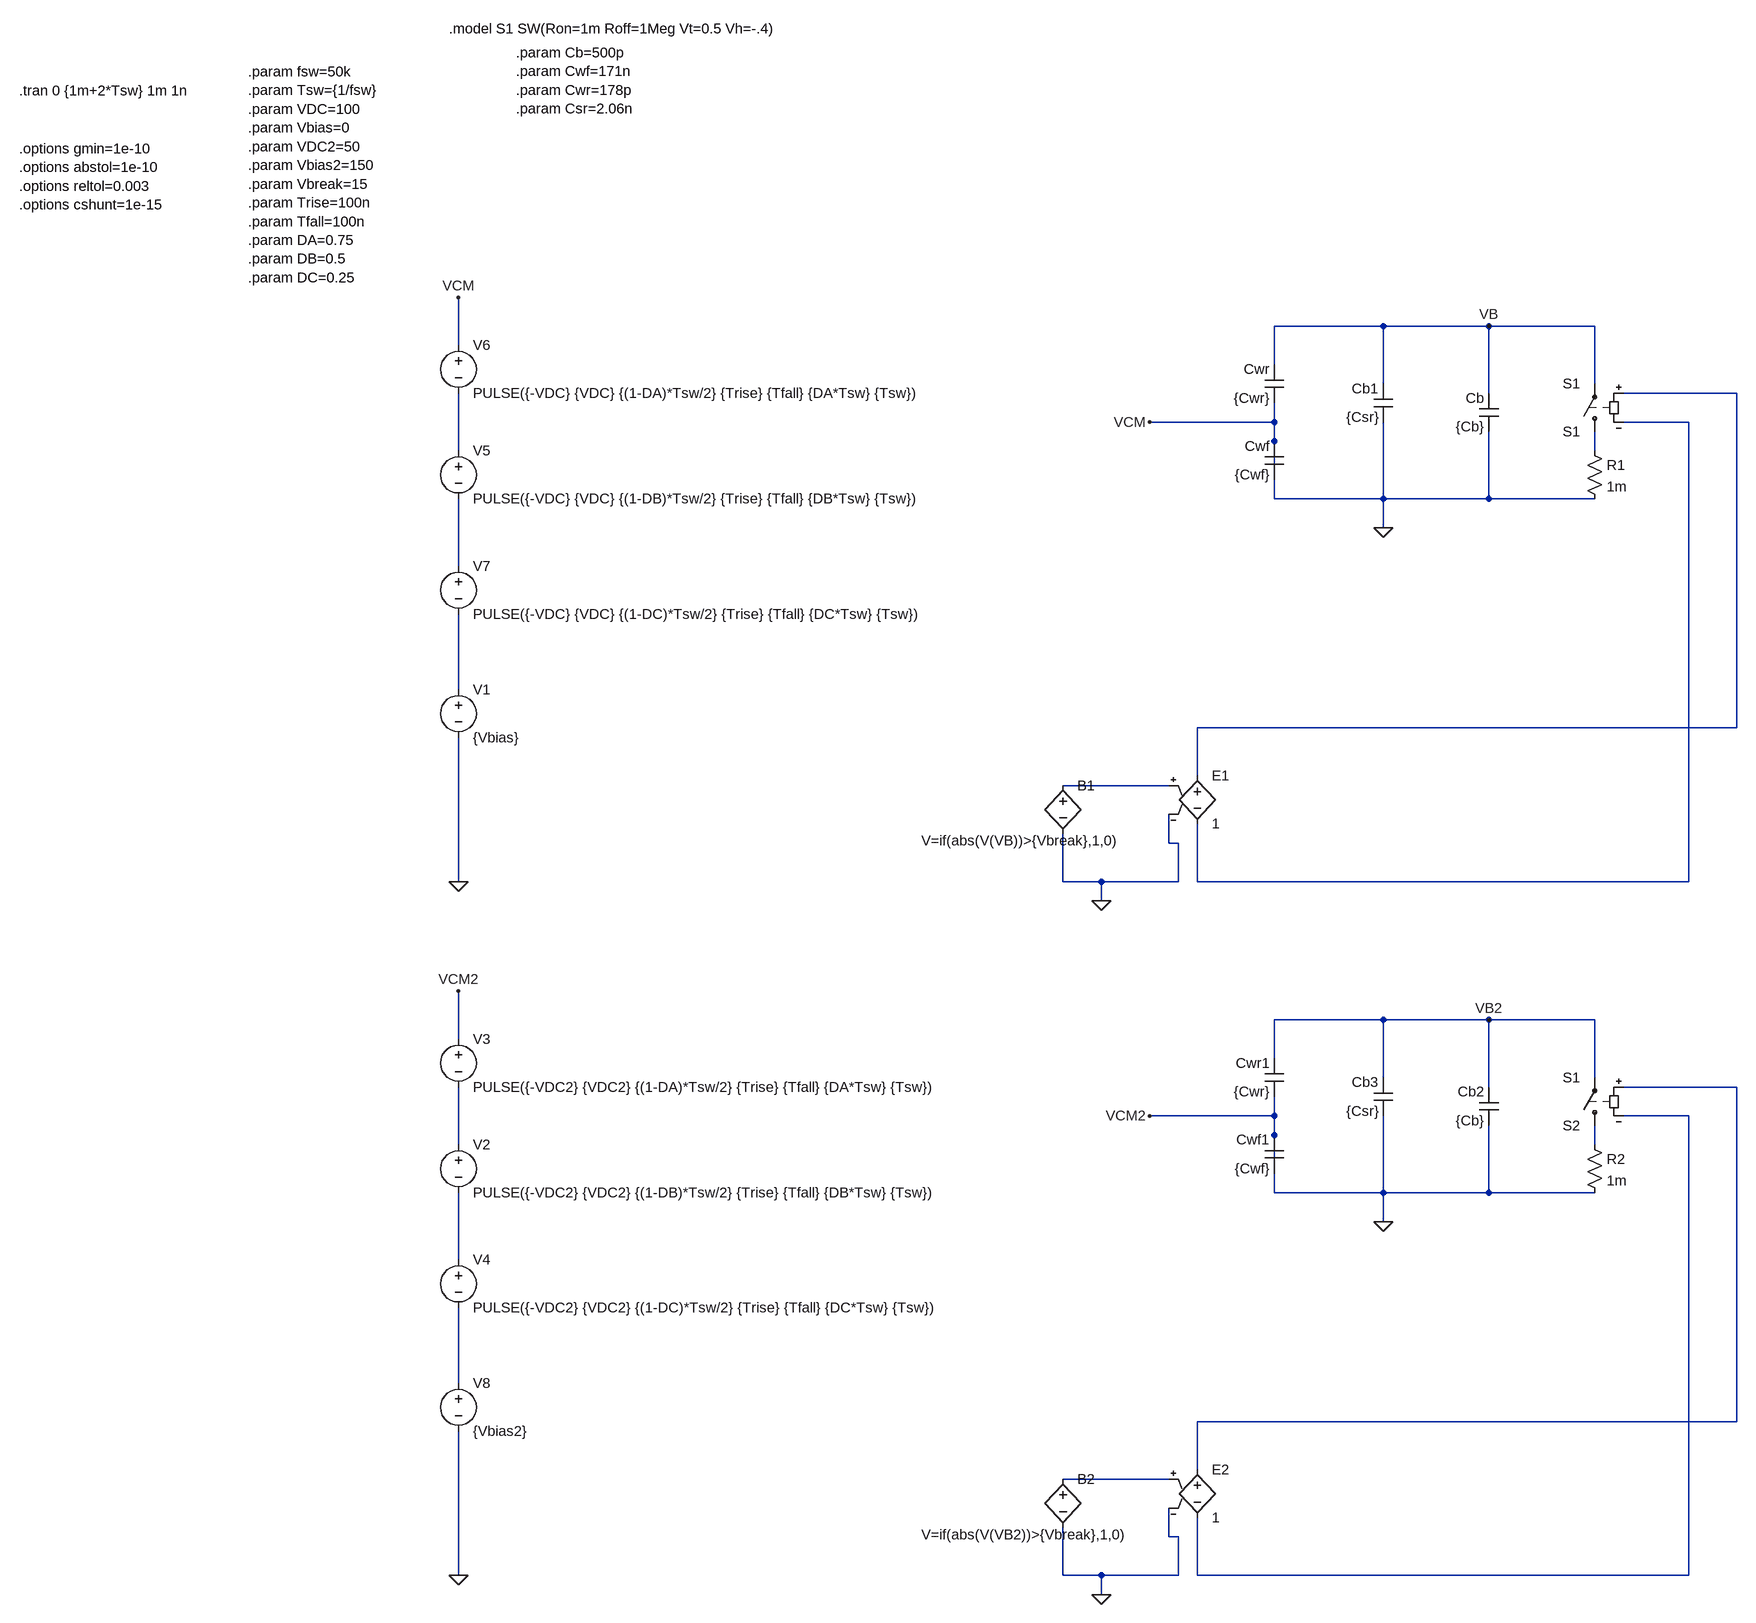
[diagram p0: schematic BearingCurrentModel.asc]
BearingCurrentModel.asc, the LTspice schematic file:
Version 4
SHEET 1 4356 2932
WIRE 496 528 304 528
WIRE 672 528 496 528
WIRE 880 528 672 528
WIRE -1056 560 -1056 480
WIRE 304 592 304 528
WIRE 496 624 496 528
WIRE 880 624 880 528
WIRE 672 640 672 528
WIRE 1152 640 928 640
WIRE 304 688 304 656
WIRE 304 688 96 688
WIRE 1072 688 928 688
WIRE 304 720 304 688
WIRE -1056 736 -1056 640
WIRE 880 736 880 704
WIRE 304 768 304 720
WIRE 304 816 304 784
WIRE 496 816 496 688
WIRE 496 816 304 816
WIRE 672 816 672 704
WIRE 672 816 496 816
WIRE 880 816 672 816
WIRE 496 864 496 816
WIRE -1056 928 -1056 816
WIRE -1056 1152 -1056 1008
WIRE 1152 1216 1152 640
WIRE 1152 1216 176 1216
WIRE 176 1296 176 1216
WIRE 128 1312 -48 1312
WIRE 128 1408 128 1360
WIRE 144 1408 128 1408
WIRE -1056 1472 -1056 1232
WIRE -48 1472 -48 1392
WIRE 16 1472 -48 1472
WIRE 144 1472 144 1408
WIRE 144 1472 16 1472
WIRE 176 1472 176 1376
WIRE 1072 1472 1072 688
WIRE 1072 1472 176 1472
WIRE 16 1504 16 1472
WIRE 496 1936 304 1936
WIRE 672 1936 496 1936
WIRE 880 1936 672 1936
WIRE -1056 1968 -1056 1888
WIRE 304 2000 304 1936
WIRE 496 2032 496 1936
WIRE 880 2032 880 1936
WIRE 672 2048 672 1936
WIRE 1152 2048 928 2048
WIRE 304 2096 304 2064
WIRE 304 2096 96 2096
WIRE 1072 2096 928 2096
WIRE 304 2128 304 2096
WIRE -1056 2144 -1056 2048
WIRE 880 2144 880 2112
WIRE 304 2176 304 2128
WIRE 304 2224 304 2192
WIRE 496 2224 496 2096
WIRE 496 2224 304 2224
WIRE 672 2224 672 2112
WIRE 672 2224 496 2224
WIRE 880 2224 672 2224
WIRE 496 2272 496 2224
WIRE -1056 2336 -1056 2224
WIRE -1056 2560 -1056 2416
WIRE 1152 2624 1152 2048
WIRE 1152 2624 176 2624
WIRE 176 2704 176 2624
WIRE 128 2720 -48 2720
WIRE 128 2816 128 2768
WIRE 144 2816 128 2816
WIRE -1056 2880 -1056 2640
WIRE -48 2880 -48 2800
WIRE 16 2880 -48 2880
WIRE 144 2880 144 2816
WIRE 144 2880 16 2880
WIRE 176 2880 176 2784
WIRE 1072 2880 1072 2096
WIRE 1072 2880 176 2880
WIRE 16 2912 16 2880
FLAG -1056 480 VCM
FLAG 96 688 VCM
FLAG 496 864 0
FLAG 16 1504 0
FLAG 672 528 VB
FLAG -1056 1472 0
FLAG -1056 1888 VCM2
FLAG 96 2096 VCM2
FLAG 496 2272 0
FLAG 16 2912 0
FLAG 672 1936 VB2
FLAG -1056 2880 0
SYMBOL cap 320 656 R180
WINDOW 0 24 56 Left 2
WINDOW 3 24 8 Left 2
SYMATTR InstName Cwr
SYMATTR Value {Cwr}
SYMBOL cap 320 784 R180
WINDOW 0 24 56 Left 2
WINDOW 3 24 8 Left 2
SYMATTR InstName Cwf
SYMATTR Value {Cwf}
SYMBOL cap 688 704 R180
WINDOW 0 24 56 Left 2
WINDOW 3 24 8 Left 2
SYMATTR InstName Cb
SYMATTR Value {Cb}
SYMBOL voltage -1056 720 R0
WINDOW 123 0 0 Left 0
WINDOW 39 0 0 Left 0
SYMATTR InstName V5
SYMATTR Value PULSE({-VDC} {VDC} {(1-DB)*Tsw/2} {Trise} {Tfall} {DB*Tsw} {Tsw})
SYMBOL voltage -1056 544 R0
WINDOW 123 0 0 Left 0
WINDOW 39 0 0 Left 0
SYMATTR InstName V6
SYMATTR Value PULSE({-VDC} {VDC} {(1-DA)*Tsw/2} {Trise} {Tfall} {DA*Tsw} {Tsw})
SYMBOL voltage -1056 912 R0
WINDOW 123 0 0 Left 0
WINDOW 39 0 0 Left 0
SYMATTR InstName V7
SYMATTR Value PULSE({-VDC} {VDC} {(1-DC)*Tsw/2} {Trise} {Tfall} {DC*Tsw} {Tsw})
SYMBOL cap 512 688 R180
WINDOW 0 24 56 Left 2
WINDOW 3 24 8 Left 2
SYMATTR InstName Cb1
SYMATTR Value {Csr}
SYMBOL e 176 1280 R0
SYMATTR InstName E1
SYMATTR Value 1
SYMBOL bv -48 1296 R0
WINDOW 3 -236 108 Left 2
SYMATTR InstName B1
SYMATTR Value V=if(abs(V(VB))>{Vbreak},1,0)
SYMBOL sw 880 720 R180
SYMATTR InstName S1
SYMATTR Value S1
SYMBOL res 864 720 R0
SYMATTR InstName R1
SYMATTR Value 1m
SYMBOL voltage -1056 1136 R0
WINDOW 123 0 0 Left 0
WINDOW 39 0 0 Left 0
SYMATTR InstName V1
SYMATTR Value {Vbias}
SYMBOL cap 320 2064 R180
WINDOW 0 24 56 Left 2
WINDOW 3 24 8 Left 2
SYMATTR InstName Cwr1
SYMATTR Value {Cwr}
SYMBOL cap 320 2192 R180
WINDOW 0 24 56 Left 2
WINDOW 3 24 8 Left 2
SYMATTR InstName Cwf1
SYMATTR Value {Cwf}
SYMBOL cap 688 2112 R180
WINDOW 0 24 56 Left 2
WINDOW 3 24 8 Left 2
SYMATTR InstName Cb2
SYMATTR Value {Cb}
SYMBOL voltage -1056 2128 R0
WINDOW 123 0 0 Left 0
WINDOW 39 0 0 Left 0
SYMATTR InstName V2
SYMATTR Value PULSE({-VDC2} {VDC2} {(1-DB)*Tsw/2} {Trise} {Tfall} {DB*Tsw} {Tsw})
SYMBOL voltage -1056 1952 R0
WINDOW 123 0 0 Left 0
WINDOW 39 0 0 Left 0
SYMATTR InstName V3
SYMATTR Value PULSE({-VDC2} {VDC2} {(1-DA)*Tsw/2} {Trise} {Tfall} {DA*Tsw} {Tsw})
SYMBOL voltage -1056 2320 R0
WINDOW 123 0 0 Left 0
WINDOW 39 0 0 Left 0
SYMATTR InstName V4
SYMATTR Value PULSE({-VDC2} {VDC2} {(1-DC)*Tsw/2} {Trise} {Tfall} {DC*Tsw} {Tsw})
SYMBOL cap 512 2096 R180
WINDOW 0 24 56 Left 2
WINDOW 3 24 8 Left 2
SYMATTR InstName Cb3
SYMATTR Value {Csr}
SYMBOL e 176 2688 R0
SYMATTR InstName E2
SYMATTR Value 1
SYMBOL bv -48 2704 R0
WINDOW 3 -236 108 Left 2
SYMATTR InstName B2
SYMATTR Value V=if(abs(V(VB2))>{Vbreak},1,0)
SYMBOL sw 880 2128 R180
SYMATTR InstName S2
SYMATTR Value S1
SYMBOL res 864 2128 R0
SYMATTR InstName R2
SYMATTR Value 1m
SYMBOL voltage -1056 2544 R0
WINDOW 123 0 0 Left 0
WINDOW 39 0 0 Left 0
SYMATTR InstName V8
SYMATTR Value {Vbias2}
TEXT -960 72 Left 2 !.param Cb=500p\n.param Cwf=171n\n.param Cwr=178p\n.param Csr=2.06n
TEXT -2120 136 Left 2 !.tran 0 {1m+2*Tsw} 1m 1n
TEXT -2120 232 Left 2 !.options gmin=1e-10   \n.options abstol=1e-10  \n.options reltol=0.003  \n.options cshunt=1e-15
TEXT -1520 104 Left 2 !.param fsw=50k\n.param Tsw={1/fsw}\n.param VDC=100\n.param Vbias=0\n.param VDC2=50\n.param Vbias2=150\n.param Vbreak=15\n.param Trise=100n\n.param Tfall=100n\n.param DA=0.75\n.param DB=0.5\n.param DC=0.25
TEXT -1072 32 Left 2 !.model S1 SW(Ron=1m Roff=1Meg Vt=0.5 Vh=-.4)

The netlist it stands for:
* BearingCurrentModel.asc
Cwr VCM VB {Cwr}
Cwf 0 VCM {Cwf}
Cb 0 VB {Cb}
V5 N003 N005 PULSE({-VDC} {VDC} {(1-DB)*Tsw/2} {Trise} {Tfall} {DB*Tsw} {Tsw})
V6 VCM N003 PULSE({-VDC} {VDC} {(1-DA)*Tsw/2} {Trise} {Tfall} {DA*Tsw} {Tsw})
V7 N005 N006 PULSE({-VDC} {VDC} {(1-DC)*Tsw/2} {Trise} {Tfall} {DC*Tsw} {Tsw})
Cb1 0 VB {Csr}
E1 N001 N002 N007 0 1
B1 N007 0 V=if(abs(V(VB))>{Vbreak},1,0)
S1 N004 VB N001 N002 S1
R1 N004 0 1m
V1 N006 0 {Vbias}
Cwr1 VCM2 VB2 {Cwr}
Cwf1 0 VCM2 {Cwf}
Cb2 0 VB2 {Cb}
V2 N010 N012 PULSE({-VDC2} {VDC2} {(1-DB)*Tsw/2} {Trise} {Tfall} {DB*Tsw} {Tsw})
V3 VCM2 N010 PULSE({-VDC2} {VDC2} {(1-DA)*Tsw/2} {Trise} {Tfall} {DA*Tsw} {Tsw})
V4 N012 N013 PULSE({-VDC2} {VDC2} {(1-DC)*Tsw/2} {Trise} {Tfall} {DC*Tsw} {Tsw})
Cb3 0 VB2 {Csr}
E2 N008 N009 N014 0 1
B2 N014 0 V=if(abs(V(VB2))>{Vbreak},1,0)
S2 N011 VB2 N008 N009 S1
R2 N011 0 1m
V8 N013 0 {Vbias2}
.param Cb=500p
.param Cwf=171n
.param Cwr=178p
.param Csr=2.06n
.tran 0 {1m+2*Tsw} 1m 1n
.options gmin=1e-10
.options abstol=1e-10
.options reltol=0.003
.options cshunt=1e-15
.param fsw=50k
.param Tsw={1/fsw}
.param VDC=100
.param Vbias=0
.param VDC2=50
.param Vbias2=150
.param Vbreak=15
.param Trise=100n
.param Tfall=100n
.param DA=0.75
.param DB=0.5
.param DC=0.25
.model S1 SW(Ron=1m Roff=1Meg Vt=0.5 Vh=-.4)
.backanno
.end